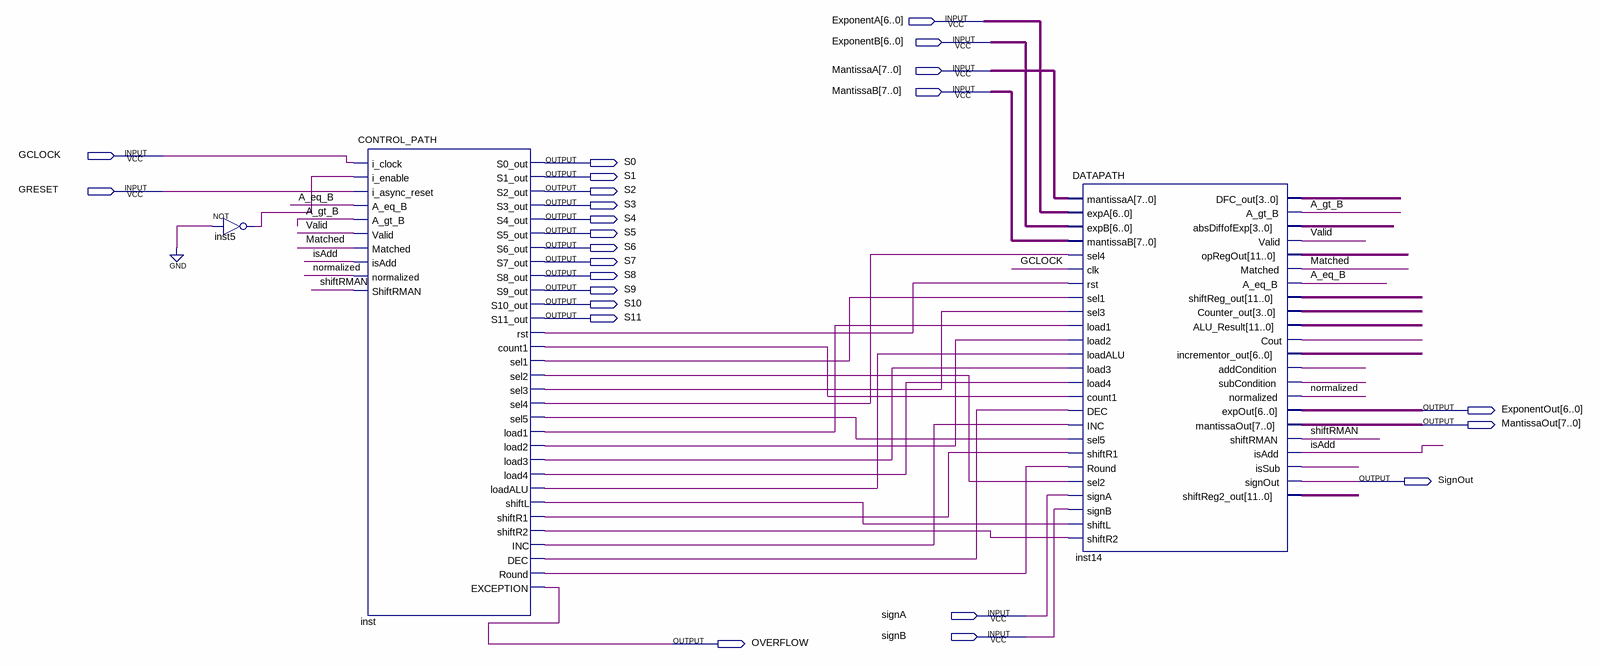
[diagram p0: schematic sheet]
// Quartus schematic FP_16bit_Adder.bdf as structural Verilog: 3 symbols, 24 pins
module FP_16bit_Adder (
  input  [6:0] ExponentA,
  input  [6:0] ExponentB,
  input  [7:0] MantissaA,
  input  [7:0] MantissaB,
  input  GCLOCK,
  input  GRESET,
  input  signA,
  input  signB,
  output S0,
  output S1,
  output S2,
  output S3,
  output S4,
  output S5,
  output S6,
  output S7,
  output S8,
  output S9,
  output S10,
  output S11,
  output [6:0] ExponentOut,
  output [7:0] MantissaOut,
  output SignOut,
  output OVERFLOW
);

  wire A_eq_B, A_gt_B, inst5_out, inst14_addcondition, inst14_cout, inst14_issub, inst14_subcondition,
       inst_count1, inst_dec, inst_inc, inst_load1, inst_load2, inst_load3, inst_load4, inst_loadalu,
       inst_round, inst_rst, inst_sel1, inst_sel2, inst_sel3, inst_sel4, inst_sel5, inst_shiftl,
       inst_shiftr1, inst_shiftr2, isAdd, Matched, normalized, shiftRMAN, Valid;
  wire [3:0] inst14_absdiffofexp, inst14_counter_out, inst14_dfc_out;
  wire [6:0] inst14_incrementor_out;
  wire [11:0] inst14_alu_result, inst14_opregout, inst14_shiftreg2_out, inst14_shiftreg_out;

  not inst5 (inst5_out, 1'b0);
  CONTROL_PATH inst (
    .i_clock(GCLOCK), .i_enable(inst5_out), .i_async_reset(GRESET), .A_eq_B(A_eq_B), .A_gt_B(A_gt_B),
    .Valid(Valid), .Matched(Matched), .isAdd(isAdd), .normalized(normalized), .ShiftRMAN(shiftRMAN),
    .S0_out(S0), .S1_out(S1), .S2_out(S2), .S3_out(S3), .S4_out(S4), .S5_out(S5), .S6_out(S6), .S7_out(S7),
    .S8_out(S8), .S9_out(S9), .S10_out(S10), .S11_out(S11), .rst(inst_rst), .count1(inst_count1),
    .sel1(inst_sel1), .sel2(inst_sel2), .sel3(inst_sel3), .sel4(inst_sel4), .sel5(inst_sel5),
    .load1(inst_load1), .load2(inst_load2), .load3(inst_load3), .load4(inst_load4), .loadALU(inst_loadalu),
    .shiftL(inst_shiftl), .shiftR1(inst_shiftr1), .shiftR2(inst_shiftr2), .INC(inst_inc), .DEC(inst_dec),
    .Round(inst_round), .EXCEPTION(OVERFLOW));
  DATAPATH inst14 (
    .mantissaA(MantissaA), .expA(ExponentA), .expB(ExponentB), .mantissaB(MantissaB), .sel4(inst_sel4),
    .clk(GCLOCK), .rst(inst_rst), .sel1(inst_sel1), .sel3(inst_sel3), .load1(inst_load1), .load2(inst_load2),
    .loadALU(inst_loadalu), .load3(inst_load3), .load4(inst_load4), .count1(inst_count1), .DEC(inst_dec),
    .INC(inst_inc), .sel5(inst_sel5), .shiftR1(inst_shiftr1), .Round(inst_round), .sel2(inst_sel2),
    .signA(signA), .signB(signB), .shiftL(inst_shiftl), .shiftR2(inst_shiftr2), .DFC_out(inst14_dfc_out),
    .A_gt_B(A_gt_B), .absDiffofExp(inst14_absdiffofexp), .Valid(Valid), .opRegOut(inst14_opregout),
    .Matched(Matched), .A_eq_B(A_eq_B), .shiftReg_out(inst14_shiftreg_out), .Counter_out(inst14_counter_out),
    .ALU_Result(inst14_alu_result), .Cout(inst14_cout), .incrementor_out(inst14_incrementor_out),
    .addCondition(inst14_addcondition), .subCondition(inst14_subcondition), .normalized(normalized),
    .expOut(ExponentOut), .mantissaOut(MantissaOut), .shiftRMAN(shiftRMAN), .isAdd(isAdd),
    .isSub(inst14_issub), .signOut(SignOut), .shiftReg2_out(inst14_shiftreg2_out));
endmodule
